# EAGLE design temp_brick (EAGLE 7.2.0)
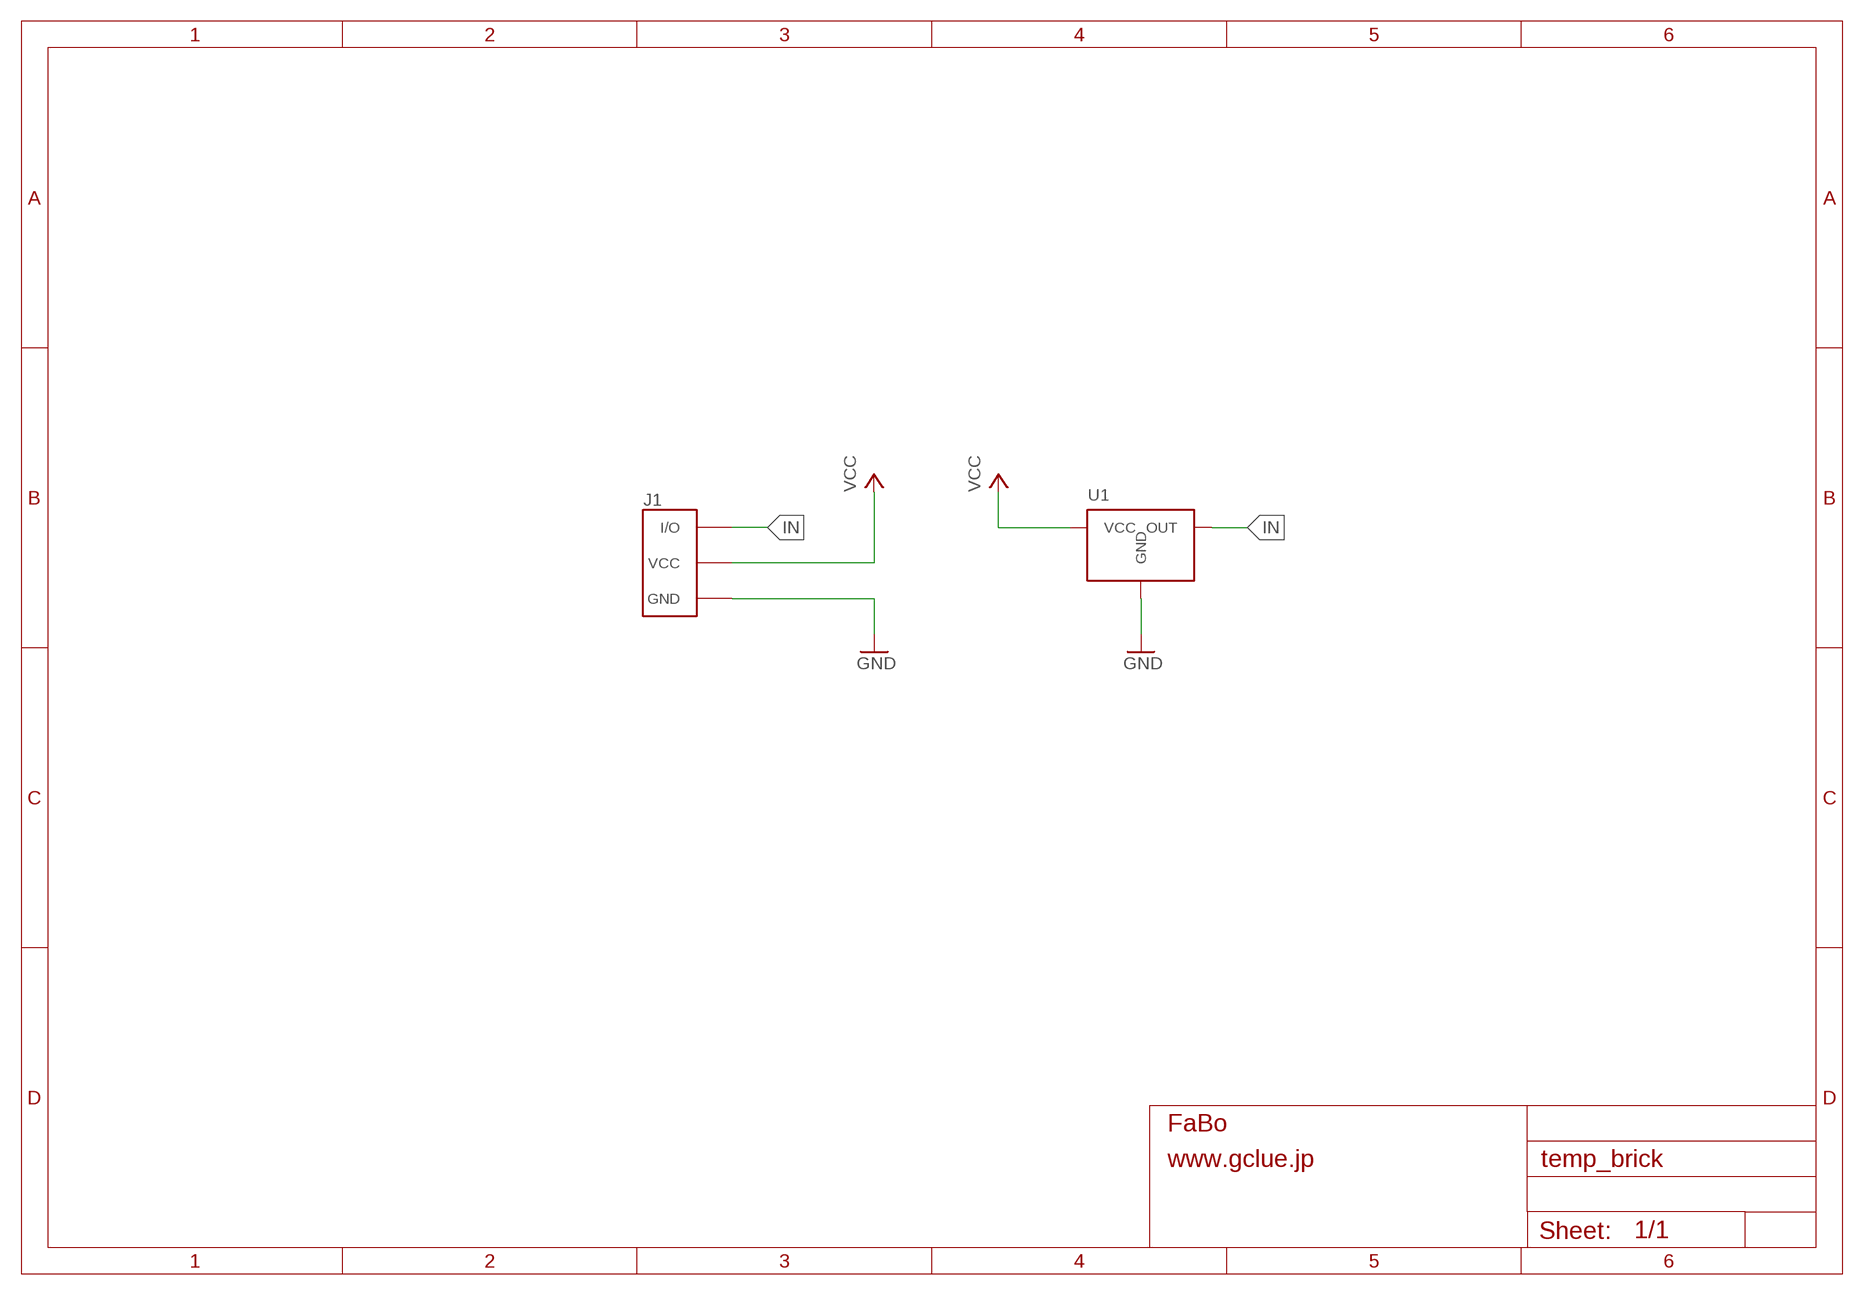
[diagram p0: schematic, sheet 1]

## Parts
J1  BRICK_3PIN  [BRICK_3PIN]
U1  SENSOR-LM60-TO92  [SENSOR-LM60-TO-92]

## Nets
GND: J1.GND U1.GND
IN: J1.IN/OUT(I/O) U1.OUT
VCC: J1.VCC U1.VCC

## Library data of the parts
J1 = Gclue:BRICK_3PIN: FaBo Brick 3pin
U1 = Gclue:SENSOR-LM60-: LM60 Temperature Sensor

## Board
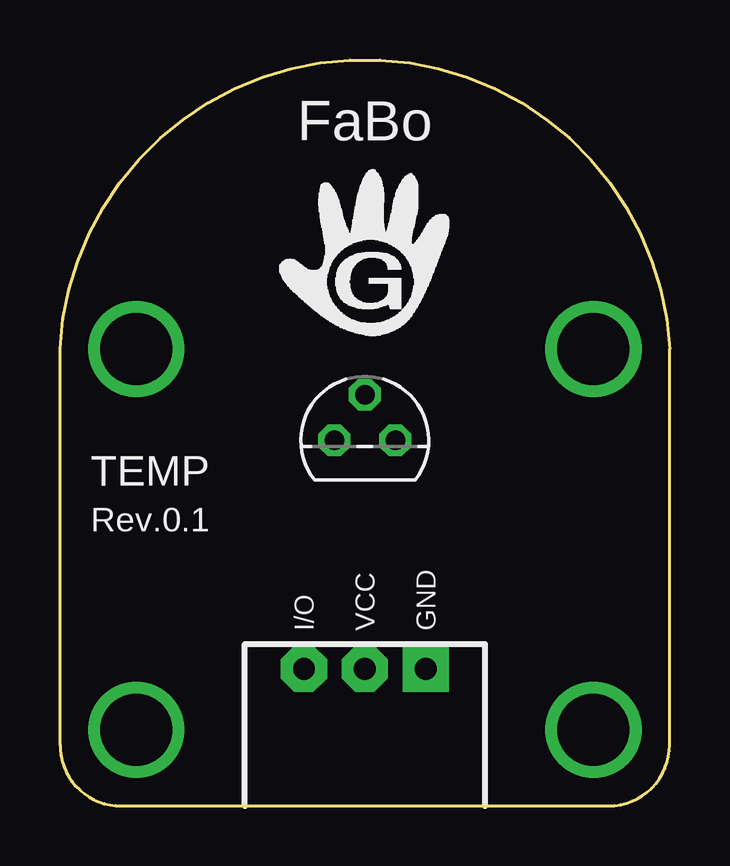
[diagram p1: board, top side]
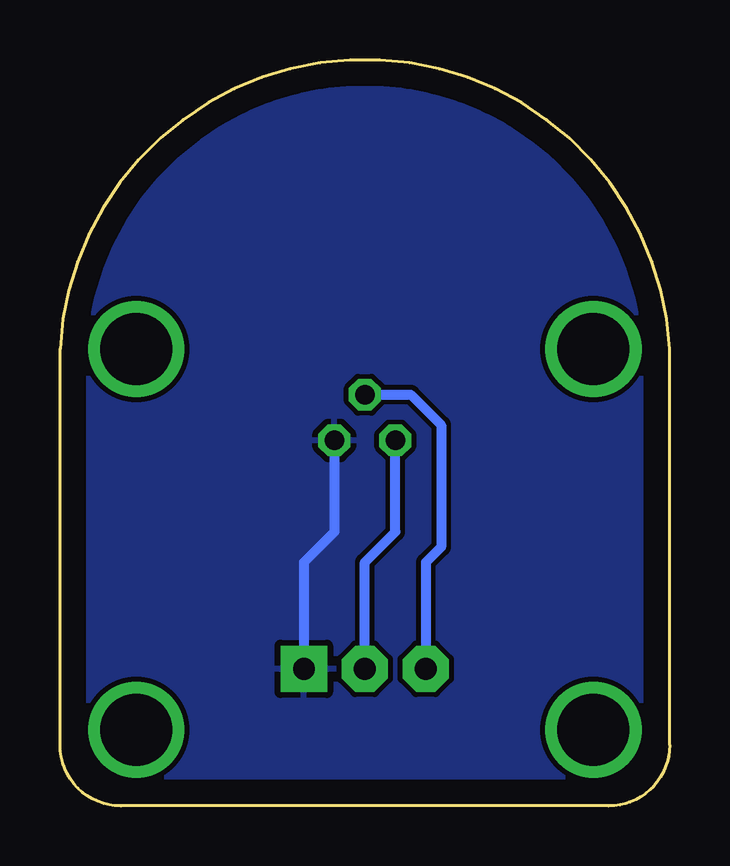
[diagram p2: board, bottom side, seen from below]

Size 25.4 x 31.1 mm. Coordinates in mm from the lower left corner, seen from the top.
Copper layers (1*16): Top 0.035mm / dielectric 1.5mm / Bottom 0.035mm
Design rules "default": minimum track width 10mil, minimum drill 24mil, track to track 8mil, track to pad 8mil, pad to pad 8mil, via to via 8mil, smd to smd 8mil, copper to edge 40mil, drill to drill 8mil, minimum pad ring 10mil, minimum via ring 8mil, stop-mask expansion 4mil, vias tented up to drill 0mil, thermal gap 10mil

### Footprints (pad centres in the part's own frame; a part is rotated, then mirrored left to right if it is on the bottom)
BRICK_3PIN = drill 0.9 pad 1.93 square: GND 2.54,-9.525 | drill 0.9 pad 1.93 octagon: IN/OUT -2.54,-9.525; VCC 0,-9.525 | drill 3 pad 3.81: P$1 -9.525,3.81; P$2 9.525,3.81; P$3 9.525,-12.065; P$4 -9.525,-12.065
SENSOR-LM60-TO-92 = drill 0.813 pad 1.27 octagon: GND 1.27,0; OUT 0,1.905; VCC -1.27,0

### Placement (x,y rotation side)
J1  12.7,15.24 0 top
U1  12.7,15.24 0 top

### Tracks (layer width: path | path; a pad name or v marks a point on that pad's centre or on a via)
GND
  Bottom 0.406: U1.GND 13.97,11.43 15.24,10.16 J1.GND
  pour Bottom: -0.64,-0.63 26.04,-0.63 26.04,31.75 -0.64,31.75
IN
  Bottom 0.406: U1.OUT 10.79,17.15 9.52,15.88 9.52,10.79 10.16,10.16 J1.IN/OUT
VCC
  Bottom 0.406: J1.VCC 12.7,10.16 11.43,11.43 U1.VCC

### Text on the board
tPlace: TEMP | Rev.0.1